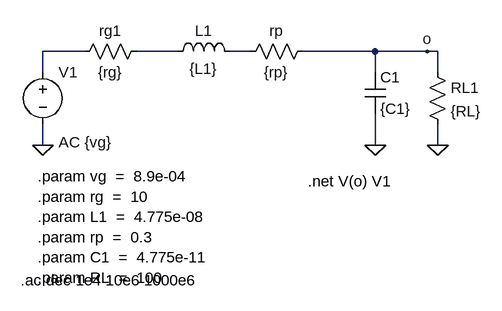
[diagram p0: schematic eje1_resuelto.asc]
eje1_resuelto.asc, the LTspice schematic file:
Version 4
SHEET 1 880 680
WIRE -32 80 -96 80
WIRE 112 80 48 80
WIRE 224 80 192 80
WIRE 416 80 304 80
WIRE 496 80 416 80
WIRE 512 80 496 80
WIRE -96 112 -96 80
WIRE 416 112 416 80
WIRE 512 112 512 80
WIRE -96 224 -96 192
WIRE 416 224 416 176
WIRE 512 224 512 192
FLAG -96 224 0
FLAG 416 224 0
FLAG 512 224 0
FLAG 496 80 o
SYMBOL voltage -96 96 R0
WINDOW 123 24 124 Left 2
WINDOW 39 0 0 Left 0
SYMATTR InstName V1
SYMATTR Value ""
SYMATTR Value2 AC {vg}
SYMBOL res 64 64 R90
WINDOW 0 0 56 VBottom 2
WINDOW 3 32 56 VTop 2
SYMATTR InstName rg1
SYMATTR Value {rg}
SYMBOL ind 96 96 R270
WINDOW 0 32 56 VTop 2
WINDOW 3 5 56 VBottom 2
SYMATTR InstName L1
SYMATTR Value {L1}
SYMBOL cap 400 112 R0
SYMATTR InstName C1
SYMATTR Value {C1}
SYMBOL res 496 96 R0
SYMATTR InstName RL1
SYMATTR Value {RL}
SYMBOL res 320 64 R90
WINDOW 0 0 56 VBottom 2
WINDOW 3 32 56 VTop 2
SYMATTR InstName rp
SYMATTR Value {rp}
TEXT -104 272 Left 2 !.param vg  =  8.9e-04 \n.param rg  =  10 \n.param L1  =  4.775e-08 \n.param rp  =  0.3 \n.param C1  =  4.775e-11 \n.param RL  =  100
TEXT -130 432 Left 2 !.ac dec 1e4 10e6 1000e6
TEXT 312 280 Left 2 !.net V(o) V1

The netlist it stands for:
* eje1_resuelto.asc
V1 N001 0 AC {vg}
rg1 N002 N001 {rg}
L1 N002 N003 {L1}
C1 o 0 {C1}
RL1 o 0 {RL}
rp o N003 {rp}
.param vg  =  8.9e-04
.param rg  =  10
.param L1  =  4.775e-08
.param rp  =  0.3
.param C1  =  4.775e-11
.param RL  =  100
.ac dec 1e4 10e6 1000e6
.net V(o) V1
.backanno
.end